# Altium schematic sheet Driver.SchDoc
size A3
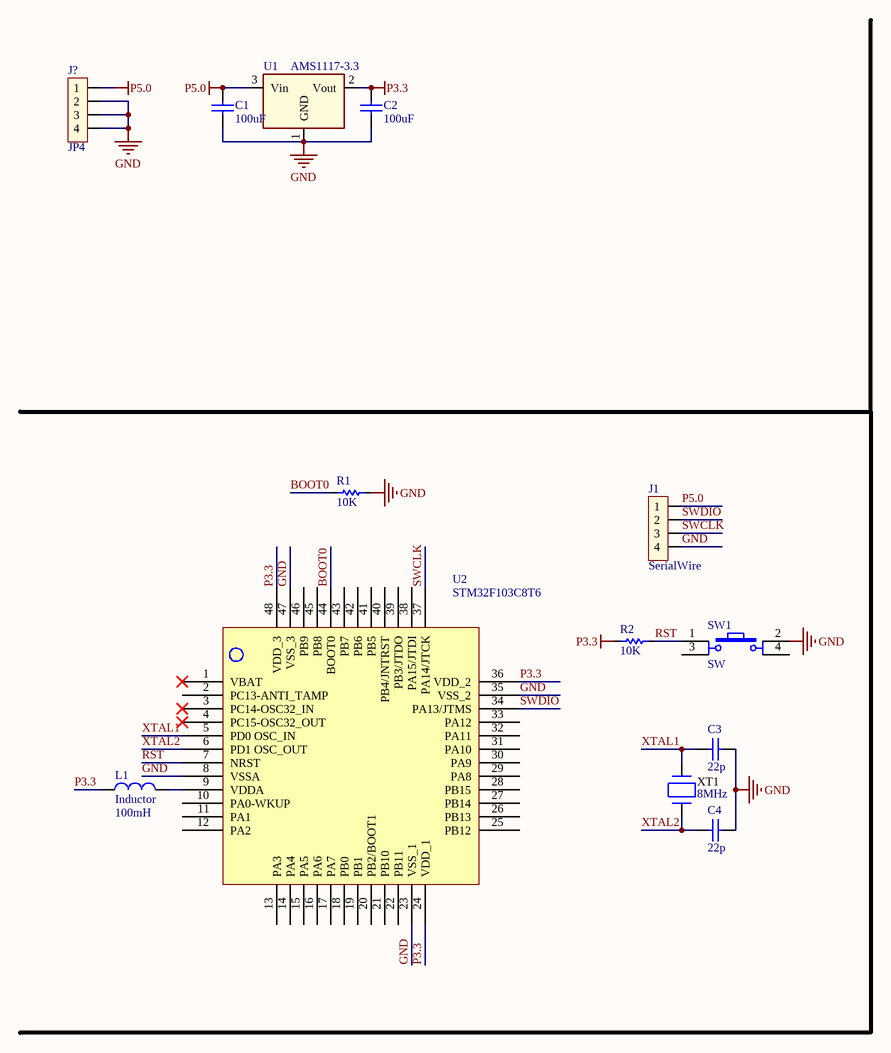
[diagram p0: Driver.SchDoc]

## Parts
C1  value 100uF  [CAP_SMD_0805]  (hidden comment: Cap Non-pol)
C2  value 100uF  [CAP_SMD_0805]  (hidden comment: Cap Non-pol)
C3  value 22p  [CAP_SMD_0805]  (hidden comment: Cap Non-pol)
C4  value 22p  [CAP_SMD_0805]  (hidden comment: Cap Non-pol)
J1  SerialWire  [CON.HDR1X4]
J?  JP4  [CON.HDR1X4]
L1  Inductor  value 100mH  [L-0805]
R1  value 10K  [RES_SMD_0805]  (hidden comment: RESISTOR)
R2  value 10K  [RES_SMD_0805]  (hidden comment: RESISTOR)
SW1  SW  [sw4_smd]
U1  AMS1117-3.3  [SOT223]
U2  STM32F103C8T6  [TQFP48L]
XT1  value 8MHz  [Crystal.HC49/USxx]  (hidden comment: Crystal2)

## Nets
GND: C1.1 C2.1 C3.2 C4.2 J1.4 J?.2 J?.3 J?.4 R1.2 SW1.2 U1.1(GND) U2.8(VSSA) U2.23(VSS_1) U2.35(VSS_2) U2.47(VSS_3)
P3.3: C2.2 L1.1 R2.1 U1.2(Vout) U2.24(VDD_1) U2.36(VDD_2) U2.48(VDD_3)
P5.0: C1.2 J1.1 J?.1 U1.3(Vin)
BOOT0: R1.1 U2.44(BOOT0)
RST: R2.2 SW1.1 U2.7(NRST)
SWCLK: J1.3 U2.37(PA14/JTCK)
SWDIO: J1.2 U2.34(PA13/JTMS)
XTAL1: C3.1 U2.5(PD0_OSC_IN) XT1.2
XTAL2: C4.1 U2.6(PD1_OSC_OUT) XT1.1
NetL1_2: L1.2 U2.9(VDDA)

Not connected (* = marked no-connect by the designer): SW1 3 4; U2 1(VBAT)* 2(PC13-ANTI_TAMP) 3(PC14-OSC32_IN)* 4(PC15-OSC32_OUT)* 10(PA0-WKUP) 11(PA1) 12(PA2) 13(PA3) 14(PA4) 15(PA5) 16(PA6) 17(PA7) 18(PB0) 19(PB1) 20(PB2/BOOT1) 21(PB10) 22(PB11) 25(PB12) 26(PB13) 27(PB14) 28(PB15) 29(PA8) 30(PA9) 31(PA10) 32(PA11) 33(PA12) 38(PA15/JTDI) 39(PB3/JTDO) 40(PB4/JNTRST) 41(PB5) 42(PB6) 43(PB7) 45(PB8) 46(PB9)

## Library data of the parts
C1-C4 = Cap Non-pol: Non-polarized Capacitor; LatestRevisionNote: Re-released for DXP Platform.; PackageReference: RAD-0.3; Publisher: Altium Limited
J1 = JP4
L1 = Inductor: Code_IEC: 1005; Published: 8-Jun-2000; LatestRevisionDate: 17-Jul-2002; LatestRevisionNote: Re-released for DXP Platform.; PackageReference: 0402-A; Publisher: Altium Limited; Code_JEITA: 0402
SW1 = SW4: Switch button 4 pin; Value: Button chip 4 pin
U1 = AMS1117: Regulator SMD Chip; Designed By: John MacTavish; Vendor: Digikey; ComponentLink1Description: Digikey Part Link; ComponentLink2Description: Open Datasheet; ComponentLink2URL: H:\LIBRARY\LIBRARY.Datasheet\
U2 = STM32F103C8T6-LQFP48: Published: 30-May-2008; DatasheetVersion: rev6, Mar-2008; PackageVersion: Mar-2008; PackageReference: LQFP48; Publisher: Altium Limited; PackageDescription: 48-Pin Low-Profile Quad Flat Pack, 7 x 7 mm Body, 0.5 mm Pitch (LQFP48); ComponentLink1Description: Manufacturer Link; ComponentLink1URL: www.st.com/stm32; ComponentLink2Description: Datasheet; ComponentLink2URL: http://www.st.com/stonline/products/literature/ds/13586.pdf
XT1 = Crystal2: Quarz Crystal; Vendor: Digikey; Published: 13-April-2009; Publisher: Hoang Nguyen; ComponentLink1Description: Digikey Part Link; ComponentLink2Description: Open Datasheet; ComponentLink2URL: H:\LIBRARY\LIBRARY.Datasheet\; Price: 2000 VND
R1 R2 = RESISTOR: Published: 8-Jun-2000; LatestRevisionDate: 17-Jul-2002; LatestRevisionNote: Re-released for DXP Platform.; PackageReference: AXIAL-0.3; Publisher: Altium Limited